# Altium project Fujitsu_ESPHome.PrjPCB
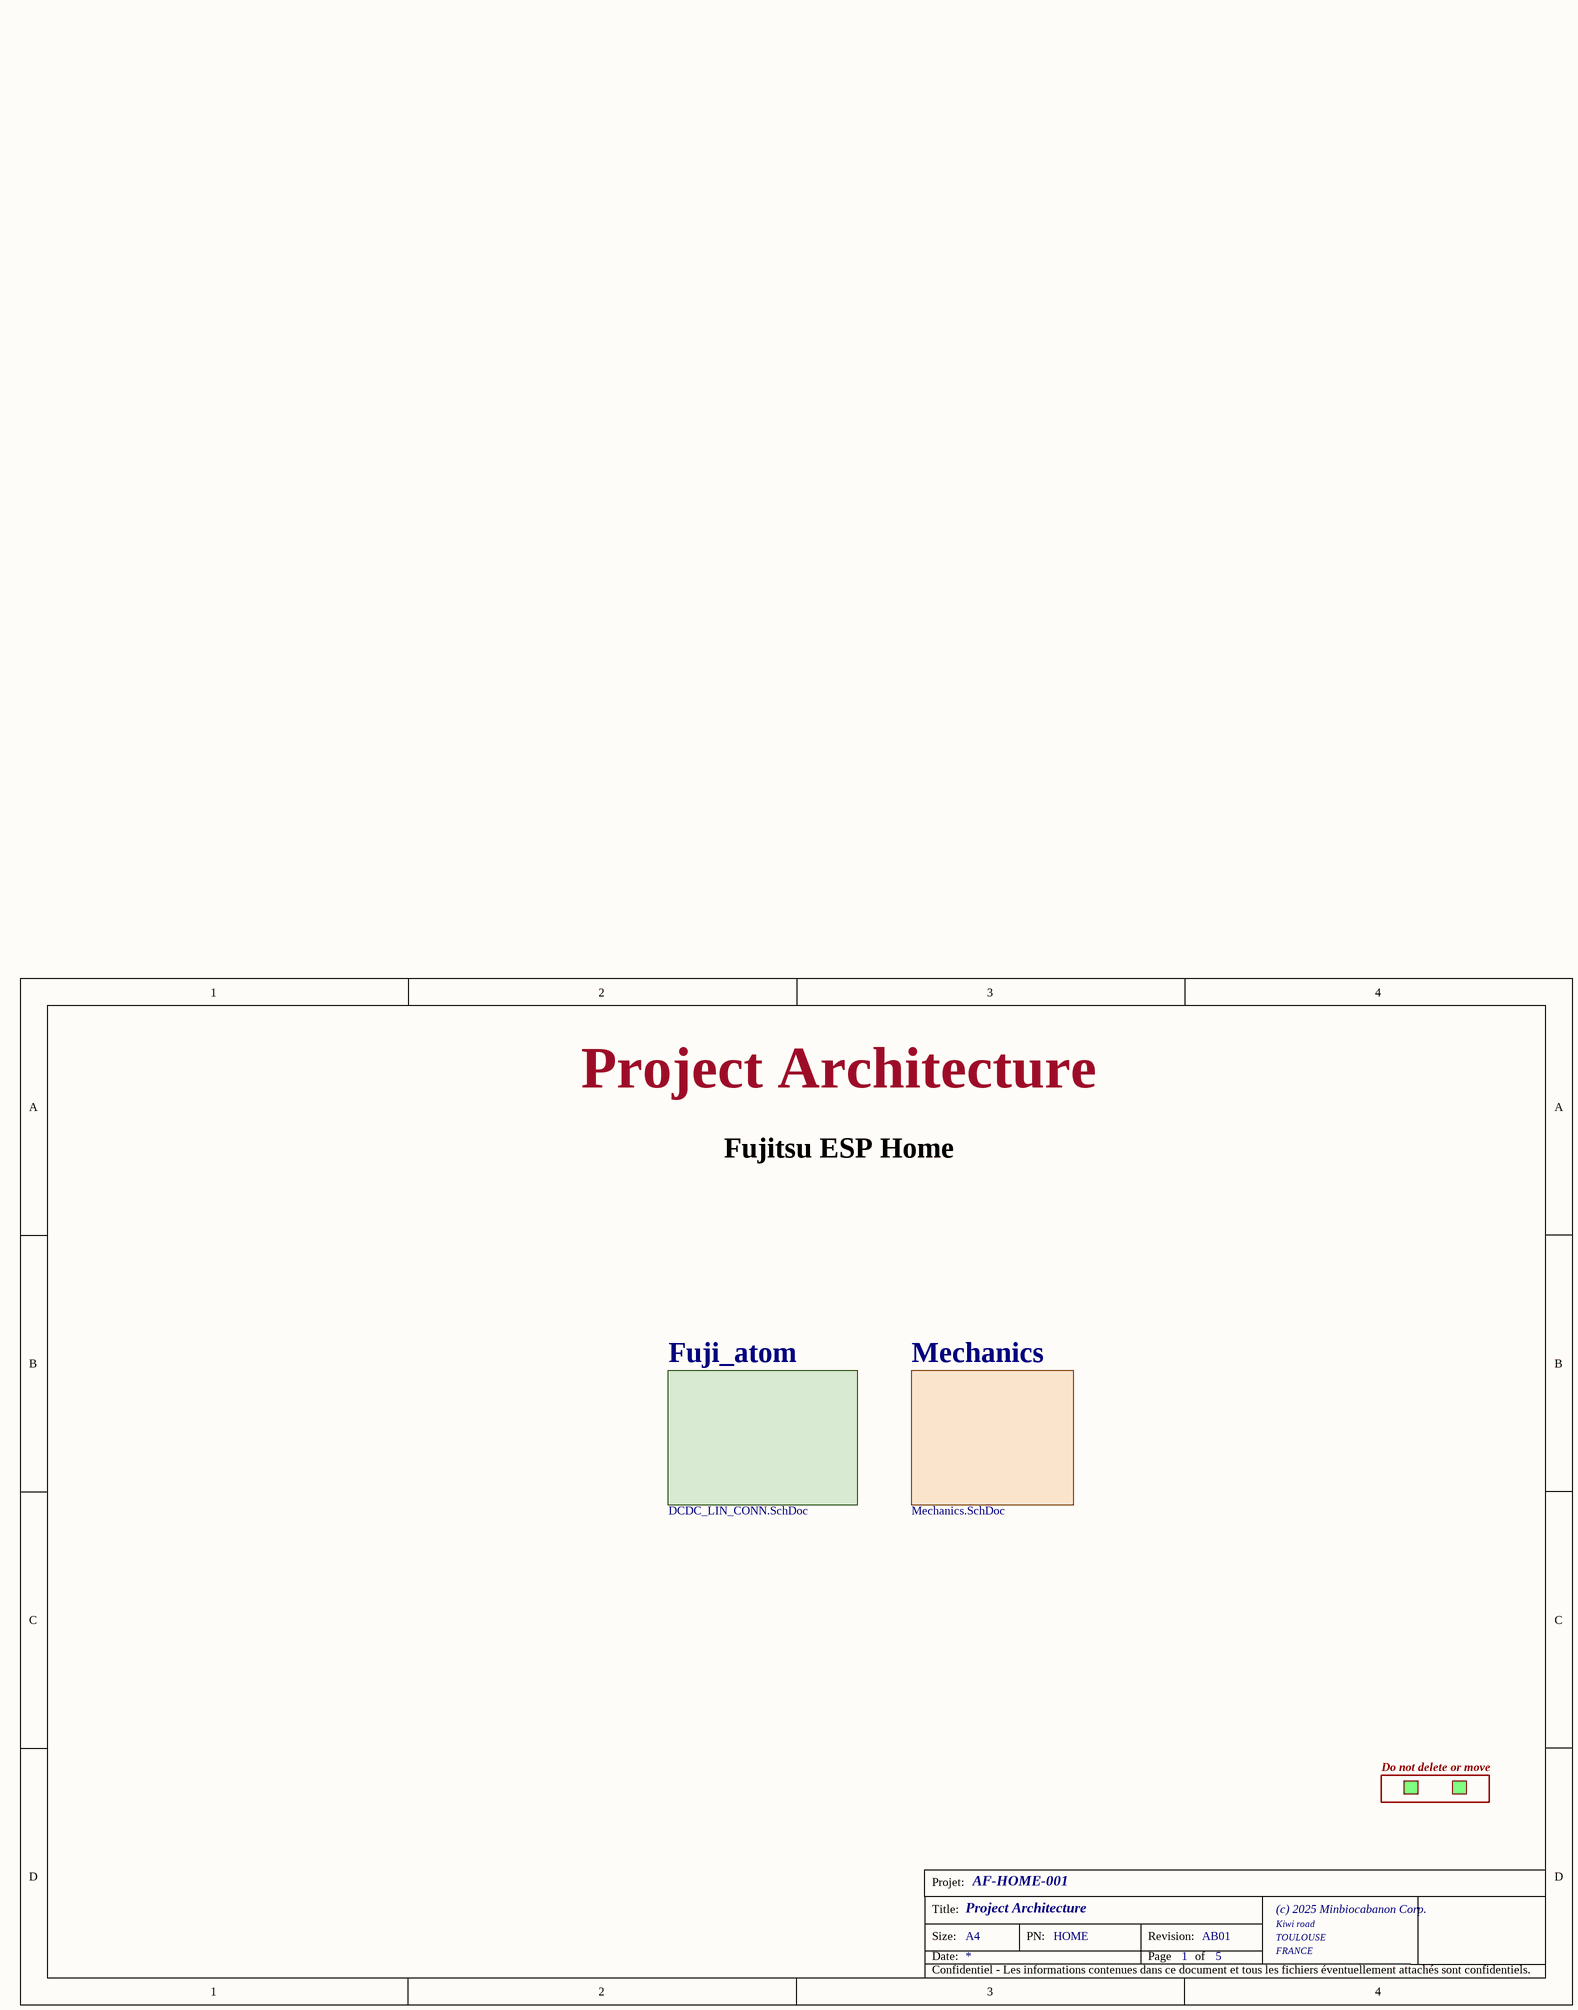
[diagram p0: Fujitsu_ESPHome.SchDoc]
VersionRevision: AB01; StencilReference: =StencilIdentifier+'-'+PartNumber+'-'+VersionRevision; StencilIdentifier: E9; Project: AF-HOME-001; PCBReference: =PCBIdentifier+'-'+PartNumber+'-'+VersionRevision; PCBIdentifier: E7; PartNumber: HOME; Engineer: Minbiocabanon; Company: (c) 2025 Minbiocabanon Corp.; BoardReference: =BoardIdentifier+'-'+PartNumber+'-'+VersionRevision; BoardIdentifier: E3; BoardDescription: Fujitsu ESP Home
5 sheets, 32 parts. Net scope: global (net labels, ports and power ports of the same name join across sheets).
Board file: Fujitsu_ESPHome.PcbDoc
Sheets:
  Fujitsu_ESPHome.SchDoc
    Designator = Revision History.SchDoc
    Designator = Cover Page.SchDoc
    Fuji_atom = DCDC_LIN_CONN.SchDoc
    Mechanics = Mechanics.SchDoc

## Sheet Fujitsu_ESPHome.SchDoc: Project Architecture
size A4; PageSetup: Record=PageOptions|CenterHorizontal=True|CenterVertical=True|PrintScale=1.07|XCorrection=1.00|YCorrection=1.00|PrintKind=1|BorderSize=5000000|LeftOffset=0|BottomOffset=0|Orientation=2|PaperLength=1000|PaperWidth=1000|Scale=100|PaperSource=7|PrintQuality=600|MediaType=1|DitherType=10|PaperKind=A3|PrintScaleMode=1; Organization: Minbiocabanon Corp.; Address2: Kiwi road; Address3: TOULOUSE; Address4: FRANCE; DocumentNumber: 1; SheetNumber: 1; SheetTotal: 5

### Sub-sheets
Designator = Revision History.SchDoc: no entries
Designator = COVER PAGE.SchDoc: no entries
Fuji_atom = DCDC_LIN_CONN.SchDoc: no entries
Mechanics = Mechanics.SchDoc: no entries

### Notes on the sheet
- Project Architecture
- Do not delete or move
- Projet:
- Title:
- Size:
- Date:
- A4
- PN:
- Revision:
- Page
- of
- Confidentiel - Les informations contenues dans ce document et tous les fichiers éventuellement attachés sont confidentiels.

## Sheet Revision History.SchDoc: Revision History
size A4; Organization: Minbiocabanon Corp.; Address2: Kiwi road; Address3: TOULOUSE; Address4: FRANCE; DocumentNumber: 3; SheetNumber: 3; SheetTotal: 5
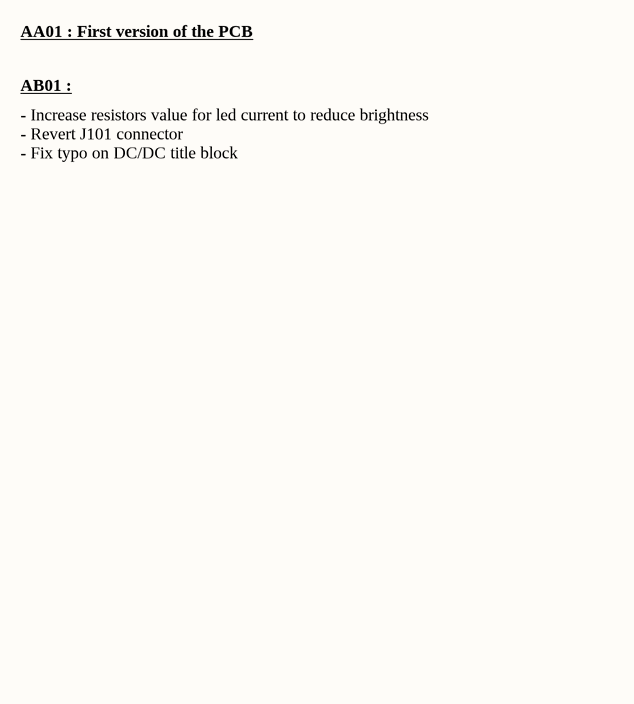
[diagram p1: Revision History.SchDoc]

### Notes on the sheet
- AA01 : First version of the PCB
- AB01 :
- - Increase resistors value for led current to reduce brightness
  - Revert J101 connector
  - Fix typo on DC/DC title block
- CLOCKS (CPU & PCIE)
- Projet:
- Title:
- Size:
- Date:
- A4
- PN:
- Revision:
- Page
- of
- Confidentiel - Les informations contenues dans ce document et tous les fichiers éventuellement attachés sont confidentiels.

## Sheet Cover Page.SchDoc: COVER PAGE
size A4; Organization: Minbiocabanon Corp.; Address2: Kiwi road; Address3: TOULOUSE; Address4: FRANCE; DocumentNumber: 2; SheetNumber: 2; SheetTotal: 5
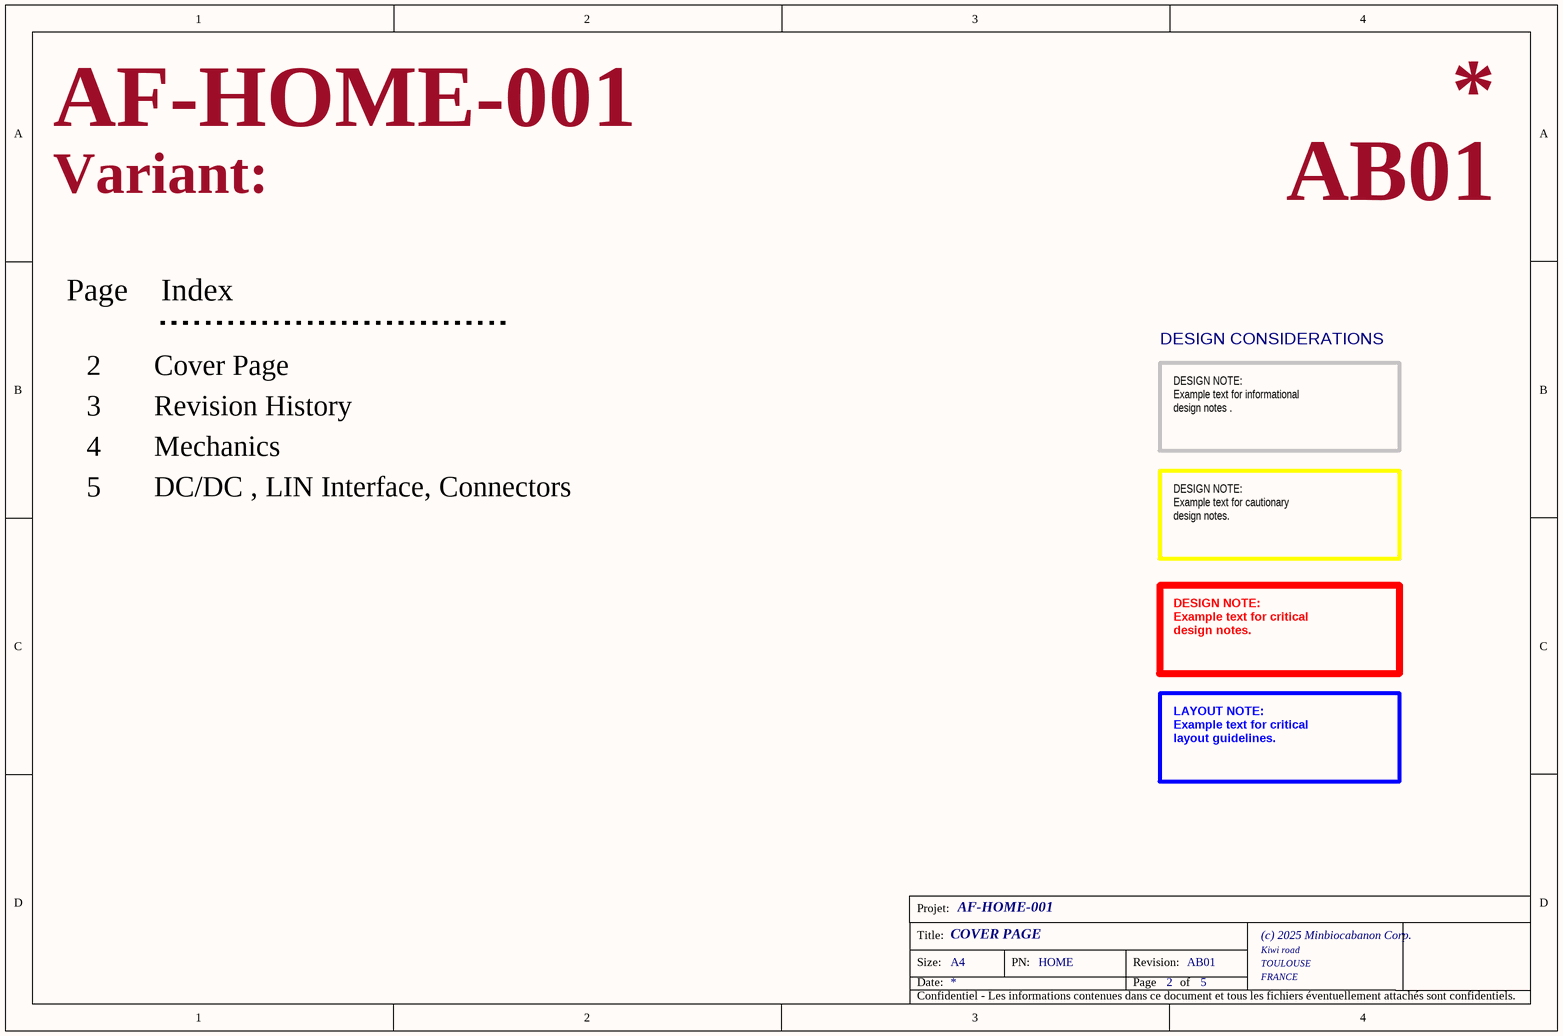
[diagram p2: Cover Page.SchDoc]

### Notes on the sheet
- Variant:
- Page
- Index
- 2
- Cover Page
- DESIGN CONSIDERATIONS
- 3
- Revision History
- DESIGN NOTE:
  Example text for informational
  design notes .
- 4
- 5
- Mechanics
- DC/DC , LIN Interface, Connectors
- DESIGN NOTE:
  Example text for cautionary
  design notes.
- DESIGN NOTE:
  Example text for critical
  design notes.
- LAYOUT NOTE:
  Example text for critical
  layout guidelines.
- Projet:
- Title:
- Size:
- Date:
- A4
- PN:
- Revision:
- of
- Confidentiel - Les informations contenues dans ce document et tous les fichiers éventuellement attachés sont confidentiels.

## Sheet DCDC_LIN_CONN.SchDoc: Fujitsu interface for M5Stack Atom - ESPHome
size A3; PageSetup: Record=PageOptions|CenterHorizontal=True|CenterVertical=True|PrintScale=1.07|XCorrection=1.00|YCorrection=1.00|PrintKind=1|BorderSize=5000000|LeftOffset=0|BottomOffset=0|Orientation=2|PaperLength=1000|PaperWidth=1000|Scale=100|PaperSource=7|PrintQuality=600|MediaType=1|DitherType=10|PaperKind=A3|PrintScaleMode=1; Organization: Minbiocabanon Corp.; Address2: Kiwi road; Address3: TOULOUSE; Address4: FRANCE; DocumentNumber: 1; SheetNumber: 5; SheetTotal: 5
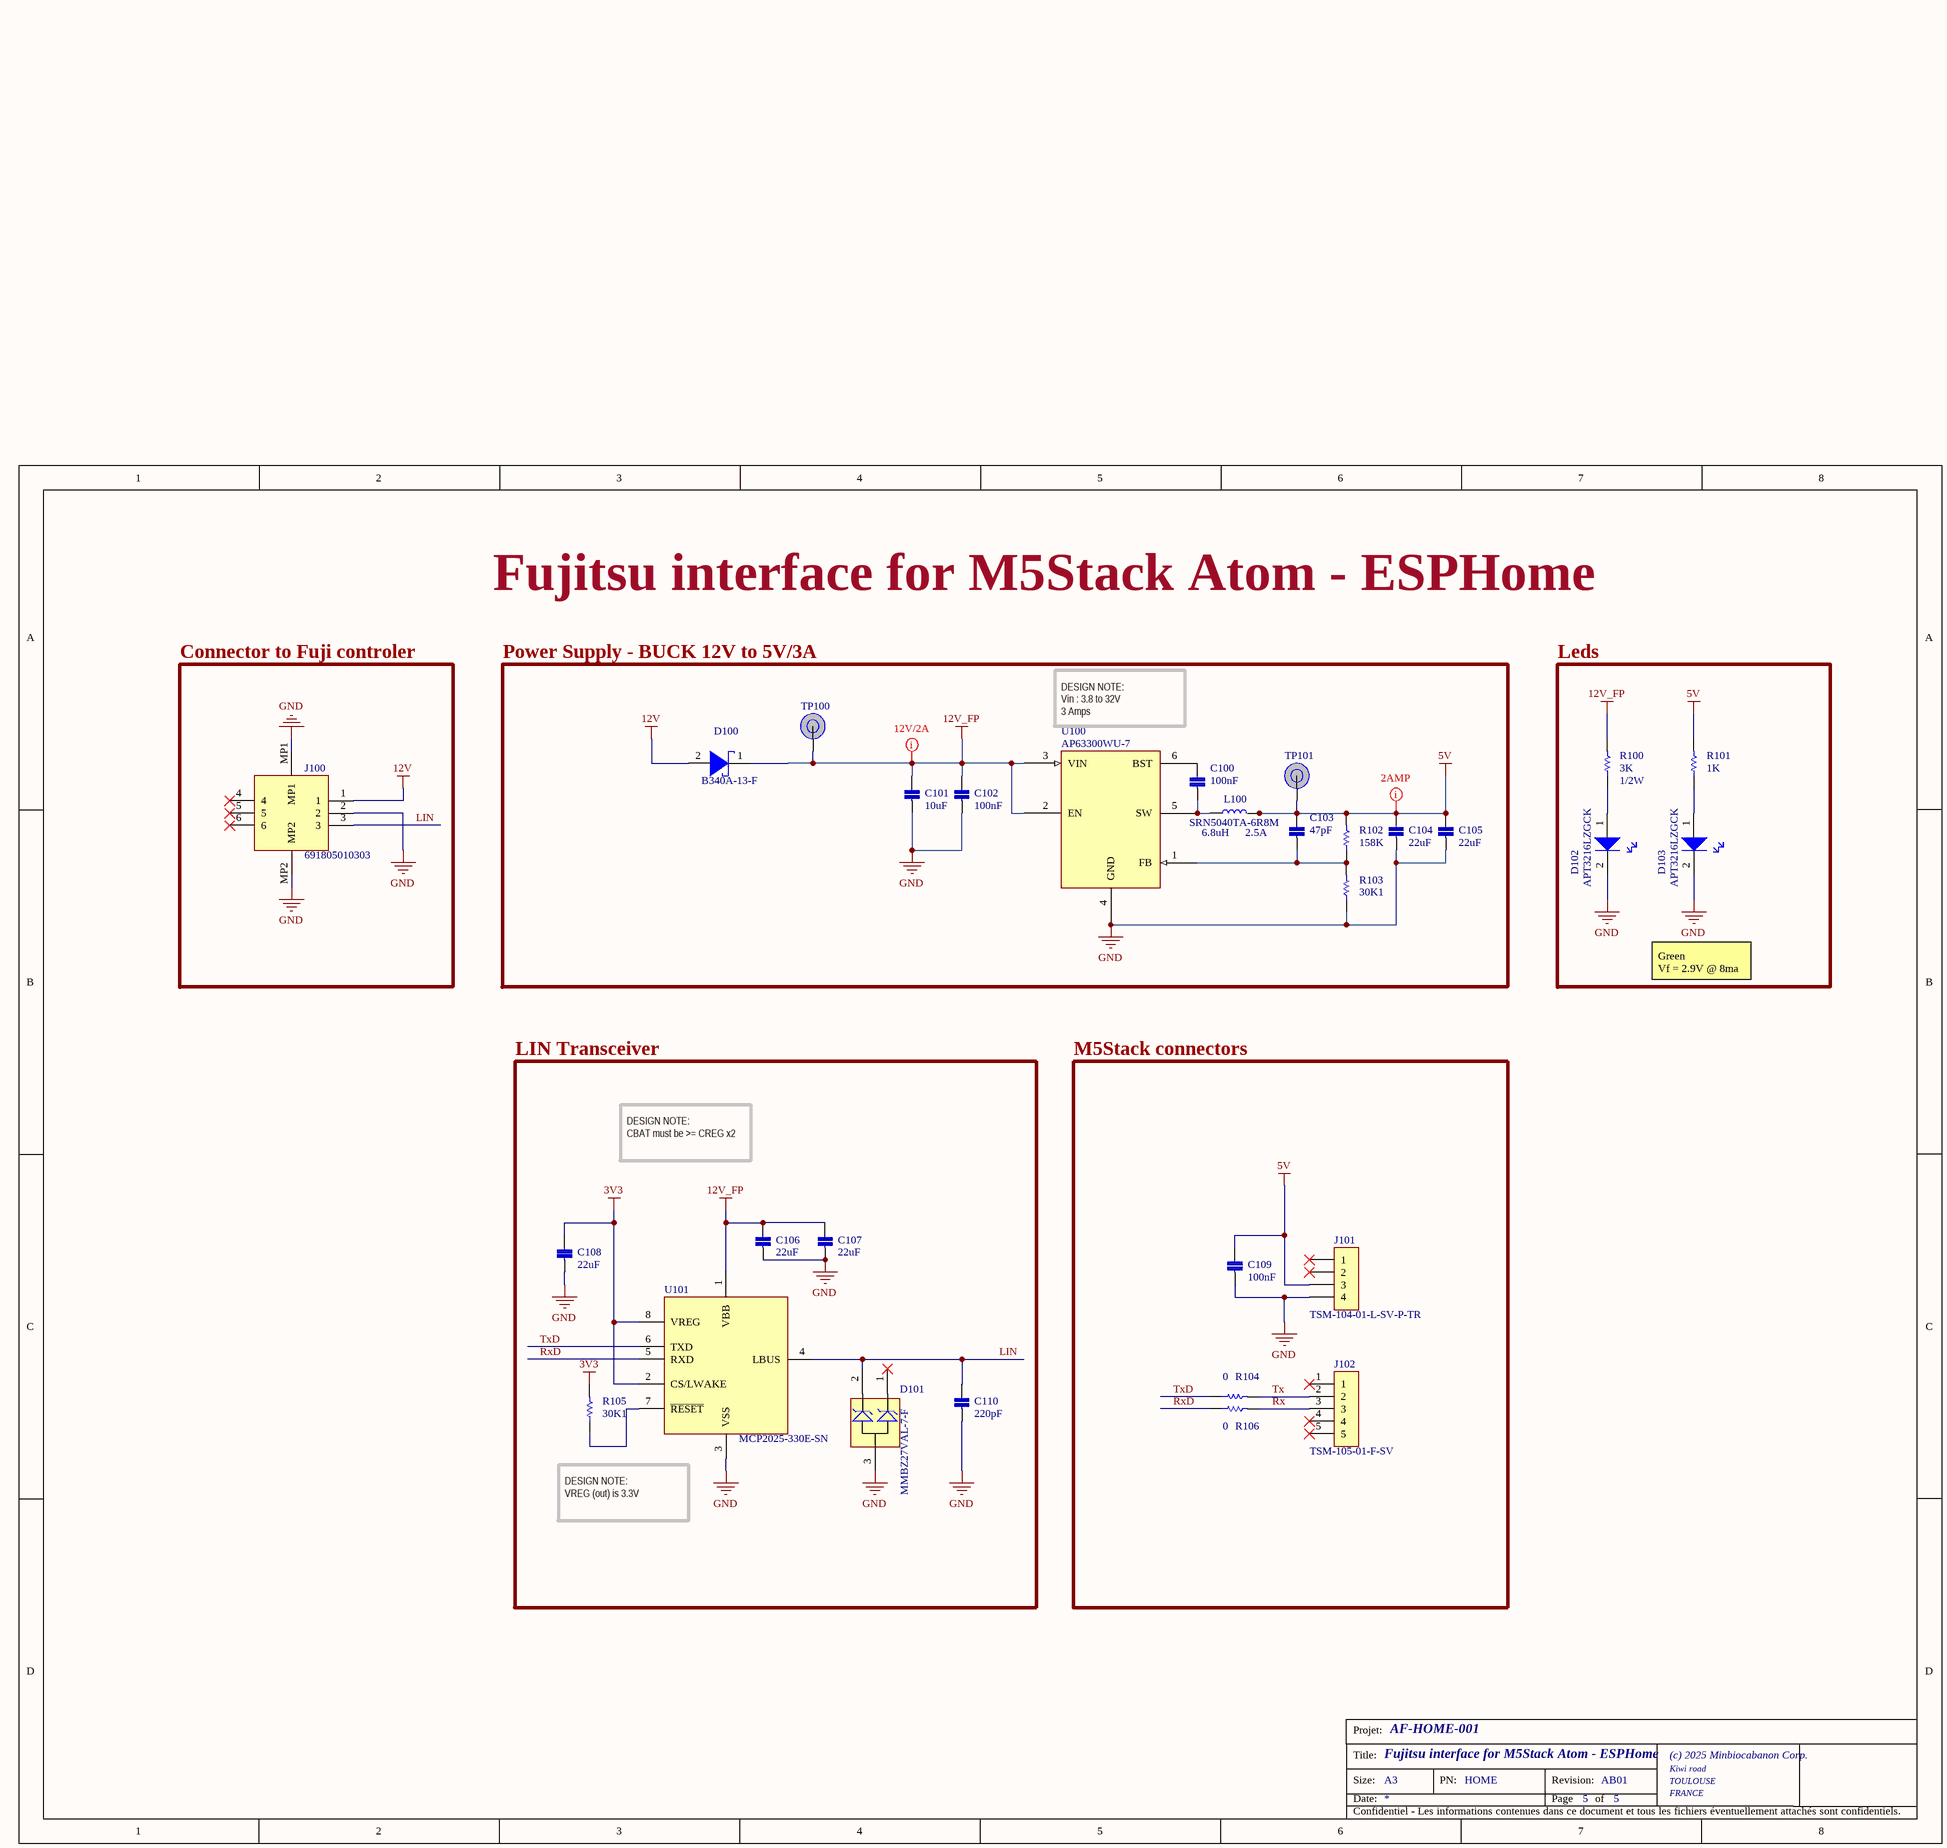
[diagram p3: DCDC_LIN_CONN.SchDoc]

### Parts
C100  100nF  [0603_CAPA]
C101  10uF  [1206_CAPA]
C102  100nF  [0603_CAPA]
C103  47pF  [0603_CAPA]
C104  22uF  [0805_CAPA]
C105  22uF  [0805_CAPA]
C106  22uF  [0805_CAPA]
C107  22uF  [0805_CAPA]
C108  22uF  [0805_CAPA]
C109  100nF  [0603_CAPA]
C110  220pF  [0603_CAPA]
D100  B340A-13-F  [DIODE_B340A-13-F]
D101  MMBZ27VAL-7-F  [ESD_MMBZ27VAL-7-F]
D102  APT3216LZGCK  [LED_APT3216LZGCK]
D103  APT3216LZGCK  [LED_APT3216LZGCK]
J100  691805010303  [691805010303]
J101  TSM-104-01-L-SV-P-TR  [TSM-104-01-L-SV-P-TR]
J102  TSM-105-01-F-SV  [TSM-105-01-F-SV]
L100  SRN5040TA-6R8M  Inductance: 6.8uH  Current Rating: 2.5A  [INDUCTOR_652-SRN5040TA-100M]
R100  3K  [0805_RES]
R101  1K  [0603_RES]
R102  158K  [0603_RES]
R103  30K1  [0603_RES]
R104  0  [0603_RES]
R105  30K1  [0603_RES]
R106  0  [0603_RES]
TP100  5V_BUCK  [PTEST]  (value not drawn)  (no BOM)
TP101  5V_BUCK  [PTEST]  (value not drawn)  (no BOM)
U100  AP63300WU-7  [POWER_BUCK_AP63300WU-7]
U101  MCP2025-330E-SN  [MCP2025-330E-SN]

### Blocks framed on the sheet
Connector to Fuji controler: J100
Power Supply - BUCK 12V to 5V/3A: C100-C105 D100 L100 R102 R103 TP100 TP101 U100
Leds: D102 D103 R100 R101
LIN Transceiver: C106-C108 C110 D101 R105 U101
M5Stack connectors: C109 J101 J102 R104 R106

### Nets
3V3: C108.1 R105.2 U101.2(CS/LWAKE) U101.8(VREG)
5V: C103.1 C104.1 C105.1 C109.1 J101.3 L100.2 R101.2 R102.2 TP101.1
12V: D100.2(A) J100.1
12V_FP: C101.1 C102.1 C106.1 C107.1 D100.1(K) R100.2 TP100.1 U100.2(EN) U100.3(VIN) U101.1(VBB)
GND: C101.2 C102.2 C104.2 C105.2 C106.2 C107.2 C108.2 C109.2 C110.2 D101.3 D102.2 D103.2 J100.2 J100.MP1 J100.MP2 J101.4 R103.1 U100.4(GND) U101.3(VSS)
LIN: C110.1 D101.2 J100.3 U101.4(LBUS)
Rx: J102.3 R106.2
RxD: R106.1 U101.5(RXD)
Tx: J102.2 R104.2
TxD: R104.1 U101.6(TXD)
NetC100_1: C100.1 U100.6(BST)
NetC100_2: C100.2 L100.1 U100.5(SW)
NetC103_2: C103.2 R102.1 R103.2 U100.1(FB)
NetD102_1: D102.1 R100.1
NetD103_1: D103.1 R101.1
NetR105_1: R105.1 U101.7(~{RESET})

Not connected (* = marked no-connect by the designer): D101 1*; J100 4* 5* 6*; J101 1* 2*; J102 1* 4* 5*

### Layout directives
net class 2AMP: 5V
net class 12V; net class 2A: 12V_FP

### Notes on the sheet
- DESIGN NOTE:
  Vin : 3.8 to 32V
  3 Amps
- (near R100) 1/2W
- Green
  Vf = 2.9V @ 8ma
- DESIGN NOTE:
  CBAT must be >= CREG x2
- DESIGN NOTE:
  VREG (out) is 3.3V
- Projet:
- Title:
- Size:
- Date:
- A3
- PN:
- Revision:
- Page
- of
- Confidentiel - Les informations contenues dans ce document et tous les fichiers éventuellement attachés sont confidentiels.

### Library data of the parts
C100 C102 C109 = CAPA_CMS_100nF_50V_0603_5%_X7R: 100nF_50V_0603_5%_X7R; Tolerance: 5%; Manufacturer Part Number: CAPA_CMS_100nF_50V_0603_5%_X7R; Mounting Type: CMS
C101 = CAPA_CMS_10uF_50V_1206_10%_X7R: 10uF_50V_1206_10%_X7R; Tolerance: 10%; Manufacturer Part Number: CAPA_CMS_10uF_50V_1206_10%_X7R; Mounting Type: CMS
C103 = CAPA_CMS_47pF_50V_0603_5%_X7R: 47pF_50V_0603_5%_X7R; Tolerance: 5%; Manufacturer Part Number: CAPA_CMS_47pF_50V_0603_5%_X7R; Mounting Type: CMS
C104-C108 = CAPA_CMS_22uF_16V_0805_10%_X5R: 22uF_16V_0805_10%_X5R; Tolerance: 10%; Manufacturer Part Number: CAPA_CMS_22uF_16V_0805_10%_X5R; Mounting Type: CMS
C110 = CAPA_CMS_220pF_50V_0603_10%_X7R: 220pF_50V_0603_10%_X7R; Tolerance: 10%; Manufacturer Part Number: CAPA_CMS_220pF_50V_0603_10%_X7R; Mounting Type: CMS
D100 = B340A-13-F: Diodes et redresseurs Schottky 40V 3A; Life Status: Active; Manufacturer Part Number: B340A-13-F; Diode Type: Schottky; Voltage Rating: 40V; Current Rating: 3A; Manufacturer: Diodes; ComponentLink1Description: https://www.mouser.fr/datasheet/2/115/ds30891-89887.pdf; Mounting Type: CMS
D101 = MMBZ27VAL-7-F: Suppresseurs ESD / diodes TVS 27V 225mW; Life Status: Active; Manufacturer Part Number: MMBZ27VAL-7-F; Diode Type: TVS; Voltage Rating: 27V; ComponentLink1Description: https://www.mouser.fr/datasheet/2/115/DIOD_S_A0012799209_1-2543783.pdf; Mounting Type: CMS
D102 D103 = APT3216LZGCK: LED CMS Green 3.2x1.6mm; Manufacturer: Kingbright; Nominal Current: 20mA; Light Intensity: 100mcd; Life Status: Active; Manufacturer Part Number: APT3216LZGCK; Color: Green; Supplier 1: Mouser; Supplier Part Number 1: 604-APT3216LZGCK; ComponentLink1Description: https://www.kingbrightusa.com/images/catalog/SPEC/APT3216LZGCK.pdf; Mounting Type: CMS
J100 = 691805010303: WR-TBL Series 8050 - 3 pins 2.50 mm Screwless SMT; Manufacturer: Wurth Elektronik; Connector Type: BORNIER; Life Status: Active; Manufacturer Part Number: 691805010303; Supplier 1: Mouser; Supplier Part Number 1: 710-691805010303; ComponentLink1Description: https://www.we-online.com/components/products/datasheet/691805010303.pdf; Mounting Type: CMS
J101 = TSM-104-01-L-SV-P-TR: Header male SMD 1x4; Manufacturer: Samtec; Life Status: Active; Manufacturer Part Number: TSM-104-01-L-SV-P-TR; Connector Type: HEADER; ComponentLink1Description: https://suddendocs.samtec.com/catalog_english/tsm.pdf; Mounting Type: CMS
J102 = TSM-105-01-F-SV: Header male SMD 1x5; Manufacturer: SAMTEC; Life Status: Active; Manufacturer Part Number: TSM-105-01-F-SV; Connector Type: HEADER; Supplier 1: Mouser; Supplier Part Number 1: 200-TSM10501FSV; ComponentLink1Description: https://suddendocs.samtec.com/catalog_english/tsm.pdf; Mounting Type: CMS
L100 = SRN5040TA-6R8M: Inductance fixes 6.8uH 2.5A; Manufacturer: Bourns; Life Status: Active; Manufacturer Part Number: SRN5040TA-6R8M; ComponentLink1Description: https://www.mouser.fr/ProductDetail/Bourns/SRN5040TA-6R8M?qs=qSfuJ%252Bfl%2Fd6O0PuOfrvvvw%3D%3D; Mounting Type: CMS
R100 = RES_CMS_3K_1/8W_0805_1%: 3K_1/8W_0805_1%; Tolerance: 1%; Manufacturer Part Number: RES_CMS_3K_1/8W_0805_1%; Mounting Type: CMS
R101 = RES_CMS_1K_1/10W_0603_1%: 1K_1/10W_0603_1%; Tolerance: 1%; Manufacturer Part Number: RES_CMS_1K_1/10W_0603_1%; Mounting Type: CMS
R102 = RES_CMS_158K_1/16W_0603_1%: 158K_1/16W_0603_1%; Tolerance: 1%; Manufacturer Part Number: RES_CMS_158K_1/16W_0603_1%; Mounting Type: CMS
R103 R105 = RES_CMS_30K1_1/10W_0603_1%: 30K1_1/10W_0603_1%; Tolerance: 1%; Manufacturer Part Number: RES_CMS_30K1_1/10W_0603_1%; Mounting Type: CMS
R104 R106 = RES_CMS_0_1/10W_0603_1%: 0_1/10W_0603_1%; Tolerance: 1%; Manufacturer Part Number: RES_CMS_0_1/10W_0603_1%; Mounting Type: CMS
TP100 TP101 = PTEST: Test point; Manufacturer: OPENINDUS; Manufacturer Part Number: PTEST; Component Type: TEST_POINT; Mounting Type: NONE
U100 = AP63300WU-7: Régulateurs de tension de commutation DCDC Conv HV Buck TSOT26 T&R 3K; Manufacturer: Diodes Incorporated; ComponentLink1Description: https://www.mouser.fr/ProductDetail/Diodes-Incorporated/AP63300WU-7?qs=%2Fha2pyFadugaSvYQ6ijkxuBwxLy95hAk9rc3GTfKFIE%3D; Manufacturer Part Number: AP63300WU-7; Component Type: POWER; Mounting Type: CMS
U101 = MCP2025-330E/SN: LIN Transceiver with Voltage Regulator SOIC 3.3V; Manufacturer: Microchip; Life Status: Active; Manufacturer Part Number: MCP2025-330E/SN; Component Type: TRANSCEIVER; Supplier 1: Mouser; Supplier Part Number 1: 579-MCP2025-330E/SN; ComponentLink1Description: https://ww1.microchip.com/downloads/en/DeviceDoc/20002306B.pdf; Mounting Type: CMS

## Sheet Mechanics.SchDoc: Mechanics
size A4; Organization: Minbiocabanon Corp.; Address2: Kiwi road; Address3: Toulouse; Address4: FRANCE; DocumentNumber: 5; SheetNumber: 4; SheetTotal: 5
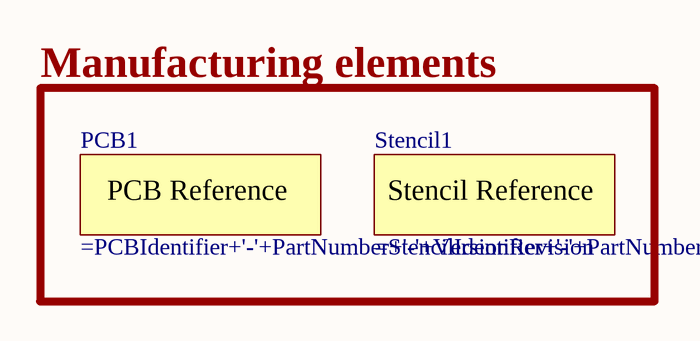
[diagram p4: Mechanics.SchDoc]

### Parts
PCB1  (no value)  (mechanical)
Stencil1  (no value)  (mechanical)

### Blocks framed on the sheet
Manufacturing elements: PCB1 Stencil1

### Notes on the sheet
- Projet:
- Title:
- Size:
- Date:
- A4
- PN:
- Revision:
- Page
- of
- Confidentiel - Les informations contenues dans ce document et tous les fichiers éventuellement attachés sont confidentiels.
- (in symbol =PCBReference) PCB Reference
- (in symbol =StencilReference) Stencil Reference

### Library data of the parts
PCB1 = =PCBReference: PCB reference; Manufacturer Part Number: =PCBIdentifier+'-'+PartNumber+'-'+VersionRevision; Component Type: BOARD_REFERENCE; Mounting Type: NONE
Stencil1 = =StencilReference: PCB stencil; Manufacturer Part Number: =StencilIdentifier+'-'+PartNumber+'-'+VersionRevision; Component Type: STENCIL; Mounting Type: NONE

## Assembly variants
Proto: all parts fitted